# Altium schematic sheet USBtoTTL.SchDoc: USBtoTTL
size A4; SheetNumber: 4; SheetTotal: 4
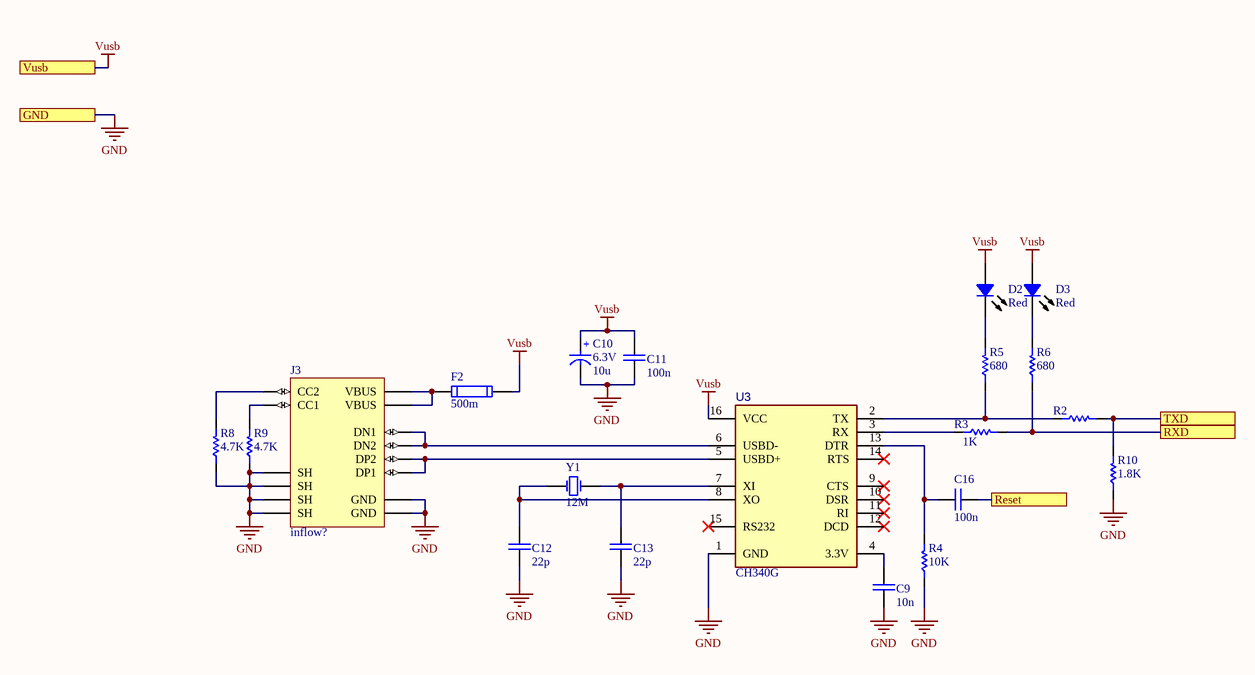
[diagram p0: USBtoTTL.SchDoc]

## Parts
C9  10n  [CAP 0805/2012]
C10  Rating: 6.3V  [SMT_C_Tantalum_A]  (hidden comment: 10u)
C11  100n  [CAP 0805/2012]
C12  22p  [CAP 0805/2012]
C13  22p  [CAP 0805/2012]
C16  100n  [CAP 0805/2012]
D2  Red  [LED 0805/2012 RED]
D3  Red  [LED 0805/2012 RED]
F2  500m  [1206_F]
J3  Inflow: inflow?  [HRO_TYPE-C-31-M-12 - Extended]  (hidden comment: 12b)
R2  1K  [RES 0805 (2012X06L)]  (value not drawn)
R3  1K  [RES 0805 (2012X06L)]
R4  10K  [RES 0805 (2012X06L)]
R5  680  [RES 0805 (2012X06L)]
R6  680  [RES 0805 (2012X06L)]
R8  4.7K  [RES 0805 (2012X06L)]
R9  4.7K  [RES 0805 (2012X06L)]
R10  1.8K  [RES 0805 (2012X06L)]
U3  CH340G  [SO16_M]
Y1  12M  [Crystal SMD]

## Ports
GND, Reset, RXD, TXD, Vusb

## Nets
GND: C9.2 C10.2(-) C11.2 C12.2 C13.2 J3.A1_B12(GND) J3.B1_A12(GND) J3.S1(SH) J3.S2(SH) J3.S3(SH) J3.S4(SH) R4.1 R8.1 R9.1 R10.1 U3.1(GND) ; port GND
Vusb: C10.1(+) C11.1 D2.1 D3.1 F2.2 U3.16(VCC) ; port Vusb
Reset: C16.2 ; port Reset
RXD: R3.2 R6.1 ; port RXD
TXD: R2.2 R10.2 ; port TXD
NetC9_1: C9.1 U3.4(3.3V)
NetC12_1: C12.1 U3.8(XO) Y1.1(OSC1)
NetC13_1: C13.1 U3.7(XI) Y1.2(OSC2)
NetC16_1: C16.1 R4.2 U3.13(DTR)
NetD2_2: D2.2 R5.2
NetD3_2: D3.2 R6.2
NetF2_1: F2.1 J3.A4_B9(VBUS) J3.B4_A9(VBUS)
NetJ3_A5: J3.A5(CC1) R9.2
NetJ3_A6: J3.A6(DP1) J3.B6(DP2) U3.5(USBD+)
NetJ3_A7: J3.A7(DN1) J3.B7(DN2) U3.6(USBD-)
NetJ3_B5: J3.B5(CC2) R8.2
NetR2_1: R2.1 R5.1 U3.2(TX)
NetR3_1: R3.1 U3.3(RX)

Not connected (* = marked no-connect by the designer): U3 9(CTS)* 10(DSR)* 11(RI)* 12(DCD)* 14(RTS)* 15(RS232)*

## Notes on the sheet
- Title:
- Project:
- Drawn by:
- Revision:
- Hossein Bagheri
- Company:
- Sheet
- of

## Library data of the parts
C9 C12 C13 = Cap_Multi_SMD_0805: Bipolar ceramic capacitor SMD; Inflow: inflow?; Type: MultiLayer; Rating: Rating?; Validation: Valid; Package: 0805
  C9: Value: 10n
  C12 C13: Value: 22p
C10 = Cap_Tantalum: Tantalum Capacitor,TAJ Series-SMD; Inflow: inflow?; Validation: Valid; Package: Package?; Type: Tantalum; Value: 10u
C11 C16 = Cap_Multi_SMD_100nF_0805: Bipolar ceramic capacitor SMD; Inflow: inflow?; Type: MultiLayer; Rating: 50V; Validation: Valid; Package: 0805; Value: 100n
D2 D3 = Semi_LED_SMD: LED; Inflow: inflow?; Rating: Rating?; Validation: Valid; Package: Package?; Type: LED; Value: Red
F2 = Other_Elec_Fuse_SMD: Short circiut  protection; Inflow: inflow?; Type: Fast; Rating: Rating?; Validation: Valid; Package: 1206; Value: 500m
J3 = Con_USB_C: USB C Female Connector; Rating: Rating?; Validation: Valid; Value: 12b; Package: SMD; Type: C
R2-R6 R8-R10 = Res_SMD_0805: Resistor; Inflow: inflow?; Rating: 0.125W; Validation: Valid; Package: 0805; Type: 10%
  R2 R3: Value: 1K
  R4: Value: 10K
  R5 R6: Value: 680
  R8 R9: Value: 4.7K
  R10: Value: 1.8K
U3 = IC_Converter_CH340G: TTL To USB Chip; Rating: Rating?; Validation: Valid; Inflow: inflow?; Type: USB to TTL; Package: SO-16; Value: CH340G
Y1 = Other_Elec_Xtal_SMD: Crystal Oscillator; Rating: Rating?; Inflow: inflow?; Validation: Valid; Package: SMD; Type: Quartz; Value: 12M